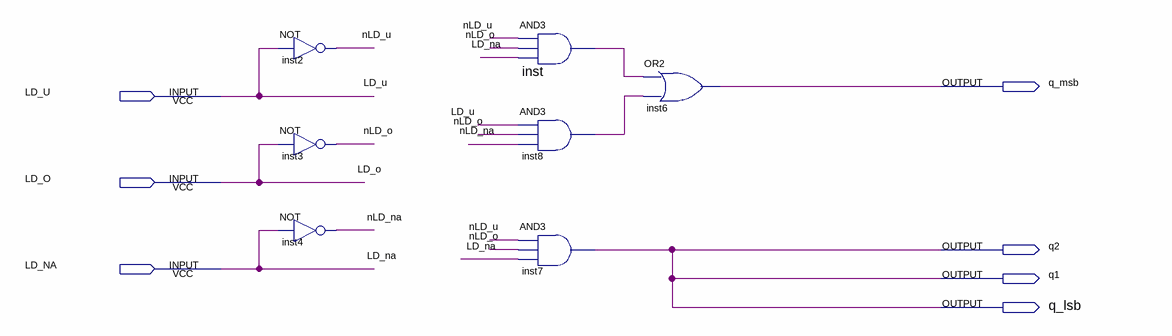
[diagram p0: schematic sheet]
// Quartus schematic load_bits.bdf as structural Verilog: 7 symbols, 7 pins
module load_bits (
  input  LD_U,
  input  LD_O,
  input  LD_NA,
  output q_msb,
  output q2,
  output q1,
  output q_lsb
);

  wire inst8_out, inst_out, nLD_na, nLD_o, nLD_u;

  not inst2 (nLD_u, LD_U);
  not inst3 (nLD_o, LD_O);
  not inst4 (nLD_na, LD_NA);
  and inst (inst_out, nLD_u, nLD_o, LD_NA);
  and inst8 (inst8_out, LD_U, nLD_o, nLD_na);
  and inst7 (q1, nLD_u, nLD_o, LD_NA);
  or inst6 (q_msb, inst_out, inst8_out);

  assign q2 = q1;
  assign q_lsb = q1;
endmodule
